# EAGLE schematic PR9001 (EAGLE 6.6.0)
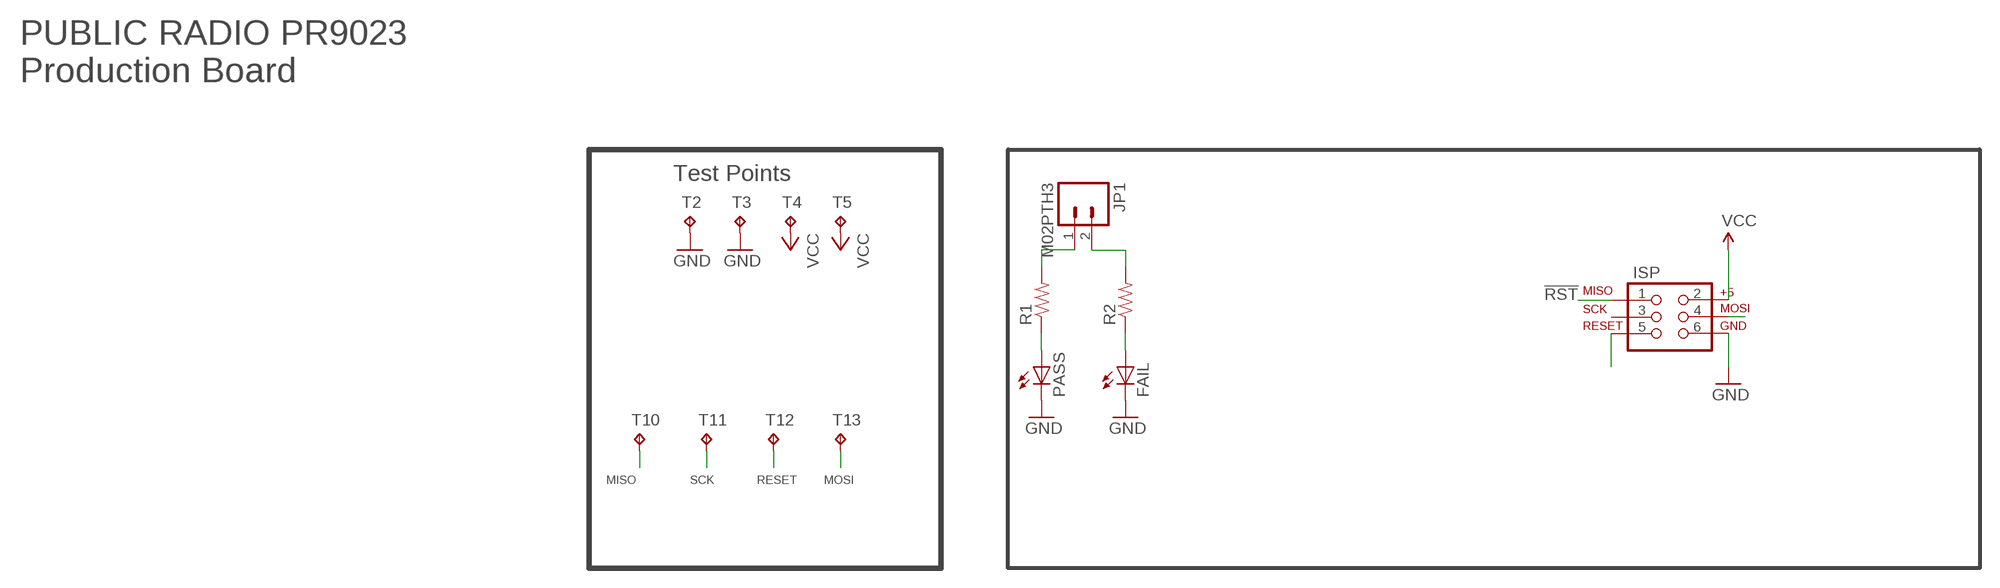
[diagram p0: schematic, sheet 1]

## Parts
FAIL  LED5MM  [LED5MM]
ISP  AVR_SPI_PRG_6NS  [2X3-NS]
JP1  M02PTH3  [1X02_LONGPADS]
PASS  LED5MM  [LED5MM]
R1  RESISTORPTH-1/4W-VERT  [AXIAL-0.1]
R2  RESISTORPTH-1/4W-VERT  [AXIAL-0.1]
T2  PR9001_TESTPOINT  [PR9001_TESTPOINT]
T3  PR9001_TESTPOINT  [PR9001_TESTPOINT]
T4  PR9001_TESTPOINT  [PR9001_TESTPOINT]
T5  PR9001_TESTPOINT  [PR9001_TESTPOINT]
T10  PR9001_TESTPOINT  [PR9001_TESTPOINT]
T11  PR9001_TESTPOINT  [PR9001_TESTPOINT]
T12  PR9001_TESTPOINT  [PR9001_TESTPOINT]
T13  PR9001_TESTPOINT  [PR9001_TESTPOINT]

## Nets
!RST: ISP.1 T10.P$1(TP)
GND: FAIL.K(C) ISP.6 PASS.K(C) T2.P$1(TP) T3.P$1(TP)
N$1: JP1.2 R2.P$2
N$2: PASS.A R1.P$1
N$3: JP1.1 R1.P$2
N$4: FAIL.A R2.P$1
RESET: ISP.5 T12.P$1(TP)
SCLK: T11.P$1(TP)
SDIO: ISP.4 T13.P$1(TP)
VCC: ISP.2 T4.P$1(TP) T5.P$1(TP)
Unconnected: ISP.3

## Notes on the sheet
- PUBLIC RADIO PR9023
  Production Board
- Test Points
- MISO | SCK | RESET | MOSI

## Library data of the parts
FAIL PASS = adafruit:LED: LED OSRAM: - CHIPLED LG R971, LG N971, LY N971, LG Q971, LY Q971, LO R971, LY R971 LH N974, LH R974 LS Q976, LO Q976, LY Q976 LO Q996 - Hyper CHIPLED LW Q18S LB Q993, LB Q99A, LB R99A - SideLED LS A670, LO A670, LY A670, LG A670, LP A670 LB A673, LV A673, LT A673, LW A673 LH A674 LY A675 LS A676, LA A676, LO A676, LY A676, LW A676 LS A679, LY A679, LG A679 - Hyper Micro SIDELED® LS Y876, LA Y876, LO Y876, LY Y876 LT Y87S - SmartLED LW L88C, LW L88S LB L89C, LB L89S, LG L890 LS L89K, LO L89K, LY L89K LS L896, LA L896, LO L896, LY L896 - TOPLED LS T670, LO T670, LY T670, LG T670, LP T670 LSG T670, LSP T670, LSY T670, LOP T670, LYG T670 LG T671, LOG T671, LSG T671 LB T673, LV T673, LT T673, LW T673 LH T674 LS T676, LA T676, LO T676, LY T676, LB T676, LH T676, LSB T676, LW T676 LB T67C, LV T67C, LT T67C, LS T67K, LO T67K, LY T67K, LW E67C LS E67B, LA E67B, LO E67B, LY E67B, LB E67C, LV E67C, LT E67C LW T67C LS T679, LY T679, LG T679 LS T770, LO T770, LY T770, LG T770, LP T770 LB T773, LV T773, LT T773, LW T773 LH T774 LS E675, LA E675, LY E675, LS T675 LS T776, LA T776, LO T776, LY T776, LB T776 LHGB T686 LT T68C, LB T68C - Hyper Mini TOPLED® LB M676 - Mini TOPLED Santana® LG M470 LS M47K, LO M47K, LY M47K Source: http://www.osram.convergy.de/
ISP = PR_Parts_Library:AVR_SPI_PRG_6: DIL VERTICAL PC TAIL PIN HEADER; MFG_PN: M20-9980346
JP1 = SparkFun-Connectors:M02: Standard 2-pin 0.1" header. Use with - straight break away headers ( PRT-00116) - right angle break away headers (PRT-00553) - swiss pins (PRT-00743) - machine pins (PRT-00117) - female headers (PRT-00115) Molex polarized connector foot print use with: PRT-08233 with associated crimp pins and housings. 2.54_SCREWTERM for use with PRT-10571. 3.5mm Screw Terminal footprints for PRT-08084 5mm Screw Terminal footprints for use with PRT-08432
R1 R2 = SparkFun-Resistors:RESISTOR: Resistor Basic schematic elements and footprints for 0603, 1206, and PTH resistors.
T2-T5 T10-T13 = PR_Parts_Library:PR9001_TESTPOINT

## Net classes
1 antenna: clearance 1.27 mm